# Altium project Handheld DMX Console - V3.PrjPcb
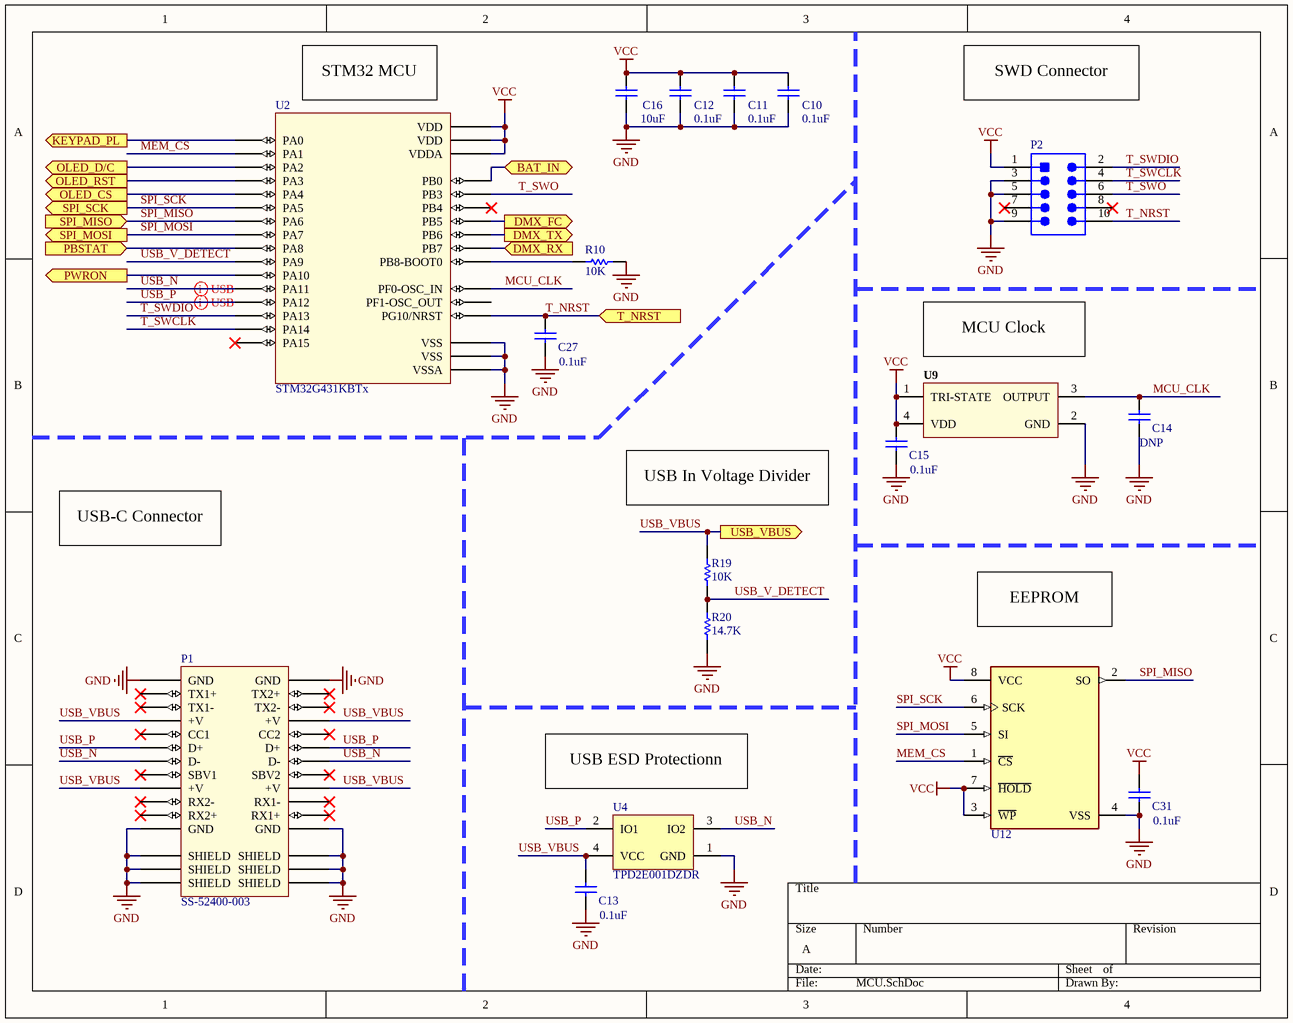
[diagram p0: MCU.SchDoc]
3 sheets, 52 parts. Net scope: flat (ports and power ports of the same name join across sheets).
Sheets:
  MCU.SchDoc
  User Interface.SchDoc
  Power.SchDoc

## Sheet MCU.SchDoc
size A; DocumentNumber: 2; SheetNumber: 2; SheetTotal: 3

### Parts
C10  0.1uF  [CAPC0603(1608)100_L]
C11  0.1uF  [CAPC0603(1608)100_L]
C12  0.1uF  [CAPC0603(1608)100_L]
C13  0.1uF  [CAPC0603(1608)100_L]
C14  DNP  [CAPC0603(1608)100_L]
C15  0.1uF  [CAPC0603(1608)100_L]
C16  10uF  [CAPC0603(1608)100_L]
C27  0.1uF  [CAPC0603(1608)100_L]
C31  0.1uF  [CAPC0603(1608)100_L]
P1  SS-52400-003  [SS-52400-00X]
P2  FTSH-105-01-F-DV-K  [SMTC-FTSH-105-01-L-DV-K_V]  (value not drawn)
R10  10K  [RESC0603(1608)_N]
R19  10K  [RESC0603(1608)_N]
R20  14.7K  [RESC0603(1608)_N]
U2  STM32G431KBTx  [LQFP32]
U4  TPD2E001DZDR  [DZD0004A_N]
U9  XLH536024.000000I  [ECS-396X_V]  (value not drawn)
U12  CAT25640VI-GT3  [FP-CAT25256VI-GT3-IPC_B]  (value not drawn)

### Ports
BAT_IN (bidir), DMX_FC (out), DMX_RX (in), DMX_TX (out), KEYPAD_PL (out), OLED_CS (out), OLED_D/C (out), OLED_RST (out), PBSTAT (in), PWRON (out), SPI_MISO (in), SPI_MOSI (out), SPI_SCK (out), T_NRST (in), USB_VBUS (out)

### Nets
GND: C10.1 C11.1 C12.1 C13.1 C14.1 C15.1 C16.1 C27.1 C31.1 P1.A1(GND) P1.A12(GND) P1.B1(GND) P1.B12(GND) P1.G1(SHIELD) P1.G2(SHIELD) P1.G3(SHIELD) P1.G4(SHIELD) P1.G5(SHIELD) P1.G6(SHIELD) P2.3 P2.5 P2.9 R10.2 R20.1 U2.14(VSSA) U2.16(VSS) U2.32(VSS) U4.1(GND) U9.2(GND) U12.4(VSS)
VCC: C10.2 C11.2 C12.2 C15.2 C16.2 C31.2 P2.1 U2.1(VDD) U2.15(VDDA) U2.17(VDD) U9.1(TRI-STATE) U9.4(VDD) U12.3(~{WP}) U12.7(~{HOLD}) U12.8(VCC)
BAT_IN: U2.13(PB0) ; port BAT_IN
MCU_CLK: C14.2 U2.2(PF0-OSC_IN) U9.3(OUTPUT)
MEM_CS: U2.6(PA1) U12.1(~{CS})
SPI_MISO: U2.11(PA6) U12.2(SO) ; port SPI_MISO
SPI_MOSI: U2.12(PA7) U12.5(SI) ; port SPI_MOSI
SPI_SCK: U2.10(PA5) U12.6(SCK) ; port SPI_SCK
T_NRST: C27.2 P2.10 U2.4(PG10/NRST) ; port T_NRST
T_SWCLK: P2.4 U2.24(PA14)
T_SWDIO: P2.2 U2.23(PA13)
T_SWO: P2.6 U2.26(PB3)
USB_N: P1.A7(D-) P1.B7(D-) U2.21(PA11) U4.3(IO2)
USB_P: P1.A6(D+) P1.B6(D+) U2.22(PA12) U4.2(IO1)
USB_V_DETECT: R19.2 R20.2 U2.19(PA9)
USB_VBUS: C13.2 P1.A4(+V) P1.A9(+V) P1.B4(+V) P1.B9(+V) R19.1 U4.4(VCC) ; port USB_VBUS
NetJ3_3: U2.28(PB5) ; port DMX_FC
NetJ3_4: U2.29(PB6) ; port DMX_TX
NetJ3_5: U2.30(PB7) ; port DMX_RX
NetR10_1: R10.1 U2.31(PB8-BOOT0)
NetU1_9: U2.18(PA8) ; port PBSTAT
NetU2_5: U2.5(PA0) ; port KEYPAD_PL
NetU2_7: U2.7(PA2) ; port OLED_D/C
NetU2_8: U2.8(PA3) ; port OLED_RST
NetU2_9: U2.9(PA4) ; port OLED_CS
NetU2_20: U2.20(PA10) ; port PWRON

Not connected (* = marked no-connect by the designer): P1 A2(TX1+)* A3(TX1-)* A5(CC1)* A8(SBV1)* A10(RX2-)* A11(RX2+)* B2(TX2+)* B3(TX2-)* B5(CC2)* B8(SBV2)* B10(RX1-)* B11(RX1+)*; P2 7* 8*; U2 3(PF1-OSC_OUT) 25(PA15)* 27(PB4)*

### Layout directives
differential pair: USB_N, USB_P

### Notes on the sheet
- (near U2) STM32 MCU
- SWD Connector
- (near U9) MCU Clock
- USB In Voltage Divider
- USB-C Connector
- EEPROM
- (near U4) USB ESD Protectionn

### Library data of the parts
C10-C16 C27 C31 = CMP-1035-00873-1: CAP 27pF 16V ±0.5pF 0603 (1608 Metric) Thickness 1mm SMD; Tolerance: Â±0.5pF; Case-Metric: 1608; Case-EIA: 0603; Value: 27pF; Max Thickness: 1 mm; Rated Voltage: 16 V; Technology: SMT
P2 = CMP-2000-05352-1: Male Header, Pitch 1.27 mm, 2 x 5 Position, Height 6.12 mm, RoHS, Tube; Manufacturer: Samtec; Number of Positions: 10; Connector Type: Header,Shrouded; Number of Positions Loaded: All; Row Spacing: 0.050"(1.27mm); Fastening Type: -; Package Reference: FTSH-105-01-L-DV-K; Termination: Solder; Package URL: http://suddendocs.samtec.com/prints/ftsh-1xx-xx-xxx-dv-xxx-footprint.pdf; Number of Rows: 2; Contact Finish Thickness: 3µin(0.08µm); Contact Type: MalePin; Manufacturer URL: http://www.samtec.com/; Contact Mating Length: 0.120"(3.05mm); Pitch: 0.050"(1.27mm); Series: FTSH; Features: -; Contact Finish: Gold; Color: Black; Family: RectangularConnectors-Headers,MalePins; Datasheet URL: http://suddendocs.samtec.com/prints/ftsh-1xx-xx-xxx-dv-xxx-mkt.pdf; Package Description: Male Header, Pitch 1.27 mm, 2 x 5 Position, Height 5.97 mm, Tail Length 4.32 mm; Mounting Type: SurfaceMount; Datasheet Version: Rev. ET, 10/1995; Category: Connectors,Interconnects; Packaging: Tube
R10 R19 R20 = CMP-1012-00001-1: Jumper 0603 (1608 Metric); Case-Metric: 1608; Value: 0.00 Ohm; Power: None; Case-EIA: 0603; Technology: SMT; Tolerance: None
U4 = CMP-2000-04961-1: Low-Capacitance 2-Channel ESD-Protection Array for High-Speed Data Interface, 0.9 to 5.5 V, -40 to 85 degC, 4-Pin SOP (DZD), Green (RoHS & no Sb/Br), Tape and Reel; Manufacturer: Texas Instruments; Manufacturer Product Page: TPD2E001DZDRSpecifications; Voltage - Reverse Standoff (Typ): 5.5V(Max); Online Catalog: TPD2ESeries; EDA / CAD Models: DownloadfromAcceleratedDesigns; Product Training Modules: ESDProtectionBasics; Bidirectional Channels: 2; Voltage - Breakdown (Min): 11V; Other Names: 296-24770-6; Power Line Protection: Yes; Package Reference: DZD4; Family: TVS-Diodes; Operating Temperature: -40degC~85degC(TA); Package / Case: TO-253-4,TO-253AA; Supplier Device Package: 4-SOP; Power - Peak Pulse: -; Type: Steering(RailtoRail); Unidirectional Channels: -; Standard Package: 1; Category: CircuitProtection; Datasheet Version: Rev. H, 08/2014; Capacitance @ Frequency: -; Packaging: Digi-Reel; Manufacturer URL: http://www.ti.com/; Series: -; Voltage - Clamping (Max) @ Ipp: -; Applications: Ethernet; Mounting Type: SurfaceMount; Current - Peak Pulse (10/1000µs): -; Datasheet URL: http://www.ti.com/general/docs/lit/getliterature.tsp?genericPartNumber=TPD2E001&fileType=pdf; Package Description: 4-Pin Small Outline Package, Body 2.92 x 1.3 mm, Pitch 1.92 mm
U9 = CMP-2000-06192-1: Clock Oscillator, 3.3 V, 25 MHz, -55 to 125 degC, 4-Pin SMD, RoHS, Tape and Reel; Manufacturer: ECS; Supply Voltage: 3.3V; Frequency Stability: 100PPM; Output Format: HCMOS; Load Capacitance: 30pF; Frequency: 25Hz; Series: ECS3963; Mounting Technology: SurfaceMount; Package / Case: 5mmx3.2mm; Dimensions: 3.2mmWx5mmL; Minimum Operating Temperature: -55C; Manufacturer URL: https://www.ecsxtal.com/; Product: SMDOscillators; Datasheet Version: 04/2012; Datasheet URL: http://www.mouser.com/ds/2/122/ecs-3961_3963-18682.pdf; Package Reference: 396X; Package Description: 4-Pin Surface Mount Device, Body 5 x 3.2 mm, Pitch 2.54 mm; Maximum Operating Temperature: +125C; RoHS: Details; Termination Style: SMD/SMT; Packaging: Reel
U12 = CMP-07117-000003-1: IC EEPROM 256K SPI 20MHZ 8SOIC; Manufacturer: ON Semiconductor; Manufacturer Part Number: CAT25256VI-GT3; Max Supply Voltage: 5.5V; Standoff Height: 0.1mm; Memory Size: 256Kbits; Nominal Supply Current: 2-4mA; Min Supply Voltage: 1.8V; RoHS: TRUE; Temperature: -40°C to +85°C; Category: IC; Mouser Description: EEPROM Serial-SPI 256K-bit 32K x 8 2.5V/3.3V/5V 8-Pin SOIC N T/R; Lead Free: Yes; Ipc Land Pattern Name: SOIC127P600X155-8; ComponentLink2Description: Datasheet; Digikey Description: IC EEPROM 256K SPI 20MHZ 8SOIC; Memory Type: EEPROM; Footprint Url: https://www.onsemi.com/pub/Collateral/751BD.PDF; Interface: SPI; Automotive: No; Device Class L2: Memory; Octopart: https://octopart.com/cat25256vi-gt3-on+semiconductor-10567745; ComponentLink2URL: https://www.onsemi.cn/PowerSolutions/document/CAT25256-D.PDF; Temperature Range Low: -40°C; Temperature Range High: +85°C; Device Class L3: EEPROM; Height: 1.75mm; Frequency: 20MHz; Package: SOIC8; Device Class L1: Integrated Circuits (ICs)

## Sheet User Interface.SchDoc
size A
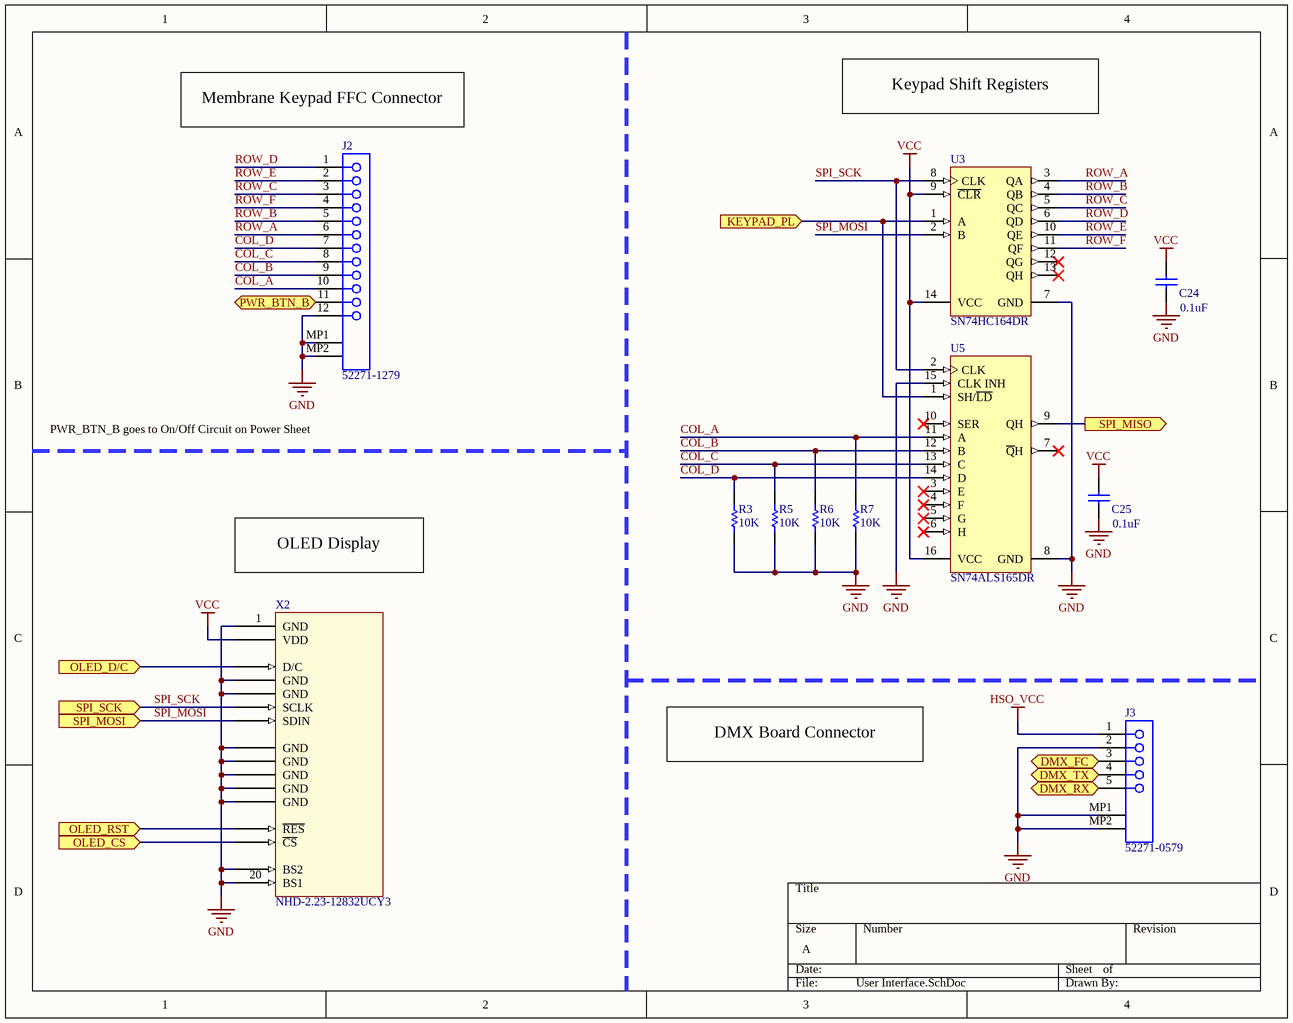
[diagram p1: User Interface.SchDoc]

### Parts
C24  0.1uF  [CAPC0603(1608)100_L]
C25  0.1uF  [CAPC0603(1608)100_L]
J2  52271-1279  [MOLX-52271-1279]
J3  52271-0579  [MOLX-52271-0579]
R3  10K  [RESC0603(1608)_N]
R5  10K  [RESC0603(1608)_N]
R6  10K  [RESC0603(1608)_N]
R7  10K  [RESC0603(1608)_N]
U3  SN74HC164DR  [D0014A_M]
U5  SN74ALS165DR  [D0016A_L]
X2  NHD-2.23-12832UCY3  [NHD-2.23-12832UCY3]

### Ports
DMX_FC (in), DMX_RX (out), DMX_TX (in), KEYPAD_PL (in), OLED_CS (in), OLED_D/C (in), OLED_RST (in), PWR_BTN_B (bidir), SPI_MISO (out), SPI_MOSI (in), SPI_SCK (in)

### Nets
GND: C24.1 C25.1 J2.12 J2.MP1 J2.MP2 J3.2 J3.MP1 J3.MP2 R3.1 R5.1 R6.1 R7.1 U3.7(GND) U5.8(GND) U5.15(CLK_INH) X2.1(GND) X2.5(GND) X2.6(GND) X2.10(GND) X2.11(GND) X2.12(GND) X2.13(GND) X2.14(GND) X2.19(BS2) X2.20(BS1)
HSO_VCC: J3.1
VCC: C24.2 C25.2 U3.9(~{CLR}) U3.14(VCC) U5.16(VCC) X2.2(VDD)
COL_A: J2.10 R7.2 U5.11(A)
COL_B: J2.9 R6.2 U5.12(B)
COL_C: J2.8 R5.2 U5.13(C)
COL_D: J2.7 R3.2 U5.14(D)
ROW_A: J2.6 U3.3(QA)
ROW_B: J2.5 U3.4(QB)
ROW_C: J2.3 U3.5(QC)
ROW_D: J2.1 U3.6(QD)
ROW_E: J2.2 U3.10(QE)
ROW_F: J2.4 U3.11(QF)
SPI_MISO: U5.9(QH) ; port SPI_MISO
SPI_MOSI: U3.2(B) X2.8(SDIN) ; port SPI_MOSI
SPI_SCK: U3.8(CLK) U5.2(CLK) X2.7(SCLK) ; port SPI_SCK
NetJ2_11: J2.11 ; port PWR_BTN_B
NetJ3_3: J3.3 ; port DMX_FC
NetJ3_4: J3.4 ; port DMX_TX
NetJ3_5: J3.5 ; port DMX_RX
NetU2_5: U3.1(A) U5.1(SH/~{LD}) ; port KEYPAD_PL
NetU2_7: X2.4(D/C) ; port OLED_D/C
NetU2_8: X2.16(~{RES}) ; port OLED_RST
NetU2_9: X2.17(~{CS}) ; port OLED_CS

Not connected (* = marked no-connect by the designer): U3 12(QG)* 13(QH)*; U5 3(E)* 4(F)* 5(G)* 6(H)* 7(~{Q}H)* 10(SER)*; X2 3(NC) 9(NC) 15(NC) 18(NC)

### Notes on the sheet
- (near J2) Membrane Keypad FFC Connector
- Keypad Shift Registers
- PWR_BTN_B goes to On/Off Circuit on Power Sheet
- OLED Display
- DMX Board Connector

### Library data of the parts
C24 C25 = CMP-1035-00873-1: as C10 on sheet MCU; Value: 27pF; Max Thickness: 1 mm; Rated Voltage: 16 V; Technology: SMT
J2 = 52271-1279: 1.0 mm Pitch Easy-On(TM) Type FPC Connector, 3.0 mm Mated Height, Right Angle, ZIF, SMT, Bottom Contact, 12 Circuits, -40 to 85 degC, ELV and RoHS Compliant, Tape and Reel; Manufacturer: Molex; Circuits (Loaded): 12; Current (Max per Contact): 0.5A; Durability (mating cycles max): 30; Entry Angle: 90degrees Angle; Mated Height: 3.00mm; Material - Metal: Phosphor Bronze; Material - Plating Mating: Tin-Bismuth; PCB Locator: No; PCB Retention: Yes; Pitch - Mating Interface: 1.00mm; Voltage (Max): 50V AC (RMS)/DC; PackageVersion: Rev. B, 04/2004; PackageReference: 52271-1279; PackageDescription: 12-Lead FPC Connector, Pitch 1.0 mm; Supplier 1: Farnell; Supplier Part Number 1: 1079952; Supplier 2: Newark; Supplier Part Number 2: 72M5544; Supplier 3: Mouser; Supplier Part Number 3: 538-52271-1279; Contact Position: Bottom; Material - Plating Termination: Tin-Bismuth; Number of Rows: 1; Orientation: Right Angle; Packing: Tape and Reel; Pitch - Termination Interface: 1.00mm; Polarized to PCB: Yes; RoHS: TRUE; Stackable: No; Mounting Technology: Surface Mount; PartNumber: 52271-1279; ComponentLink1Description: Manufacturer URL; ComponentLink1URL: http://www.molex.com/molex/index.jsp; ComponentLink2Description: Datasheet; ComponentLink2URL: http://www.molex.com/webdocs/datasheets/pdf/en-us/0522711279_FFC_FPC_CONNECTORS.pdf; ComponentLink3Description: Package Specification; ComponentLink3URL: http://www.molex.com/pdm_docs/sd/522711279_sd.pdf
J3 = 52271-0579: 1.0 mm Pitch Easy-On(TM) Type FPC Connector, 3.0 mm Mated Height, Right Angle, ZIF, SMT, Bottom Contact, 5 Circuits, -40 to 85 degC, ELV and RoHS Compliant, Tape and Reel; Manufacturer: Molex; Circuits (Loaded): 5; Current (Max per Contact): 0.5A; Durability (mating cycles max): 30; Entry Angle: 90degrees Angle; Mated Height: 3.00mm; Material - Metal: Phosphor Bronze; Material - Plating Mating: Tin-Bismuth; PCB Locator: No; PCB Retention: Yes; Pitch - Mating Interface: 1.00mm; Voltage (Max): 50V AC (RMS)/DC; PackageVersion: Rev. B, 04/2004; PackageReference: 52271-0579; PackageDescription: 5-Lead FPC Connector, Pitch 1.0 mm; Supplier 1: Mouser; Supplier Part Number 1: 538-52271-0579; Contact Position: Bottom; Material - Plating Termination: Tin-Bismuth; Number of Rows: 1; Orientation: Right Angle; Packing: Tape and Reel; Pitch - Termination Interface: 1.00mm; Polarized to PCB: Yes; RoHS: TRUE; Stackable: No; Mounting Technology: Surface Mount; PartNumber: 52271-0579; ComponentLink1Description: Manufacturer URL; ComponentLink1URL: http://www.molex.com/molex/index.jsp; ComponentLink2Description: Datasheet; ComponentLink2URL: http://www.molex.com/webdocs/datasheets/pdf/en-us/0522710579_FFC_FPC_CONNECTORS.pdf; ComponentLink3Description: Package Specification; ComponentLink3URL: http://www.molex.com/pdm_docs/sd/522710579_sd.pdf
R3 R5-R7 = CMP-1012-00001-1: as R10 on sheet MCU; Technology: SMT; Tolerance: None
U3 = CMP-0780-00006-3: 8-Bit Parallel-Out Serial Shift Registers, D0014A, LARGE T&R; Manufacturer: Texas Instruments; 3-State Output: No; F @ Nom Voltage(Max)(Mhz): 28; Bits: 8; Output Type: CMOS; VCC(Max)(V): 6; Technology Family: HC; VCC(Min)(V): 2; tpd @ Nom Voltage(Max)(ns): 38; ICC @ Nom Voltage(Max)(mA): 0.08; Rating: Catalog; Output Drive (IOL/IOH)(Max)(mA): 5.2/-5.2; PackageVersion: http://www.ti.com/lit/ml/mpds177g/mpds177g.pdf; Voltage(Nom)(V): 6; Code_JEDEC: MS-012; DatasheetVersion: SCLS115F; Generic Part Number: SN74HC164; Operating Temperature Range(C): -40 to 125; Input Type: CMOS; PackageReference: D0014A
U5 = CMP-0780-00014-3: Parallel-Load 8-Bit Serial Shift Registers, D0016A, LARGE T&R; Manufacturer: Texas Instruments; VCC(Min)(V): 4.5; Output Type: TTL; Bits: 8; ICC @ Nom Voltage(Max)(mA): 24; F @ Nom Voltage(Max)(Mhz): 75; tpd @ Nom Voltage(Max)(ns): 14; 3-State Output: No; Technology Family: ALS; Voltage(Nom)(V): 5; Output Drive (IOL/IOH)(Max)(mA): 8/-0.4; VCC(Max)(V): 5.5; Rating: Catalog; Operating Temperature Range(C): 0 to 70; DatasheetVersion: SDAS157B; Generic Part Number: SN74ALS165; Input Type: TTL; PackageVersion: http://www.ti.com/lit/ml/mpds178g/mpds178g.pdf; Code_JEDEC: MS-012 variation AC; PackageReference: D0016A

## Sheet Power.SchDoc
size A; DocumentNumber: 1; SheetNumber: 1; SheetTotal: 3
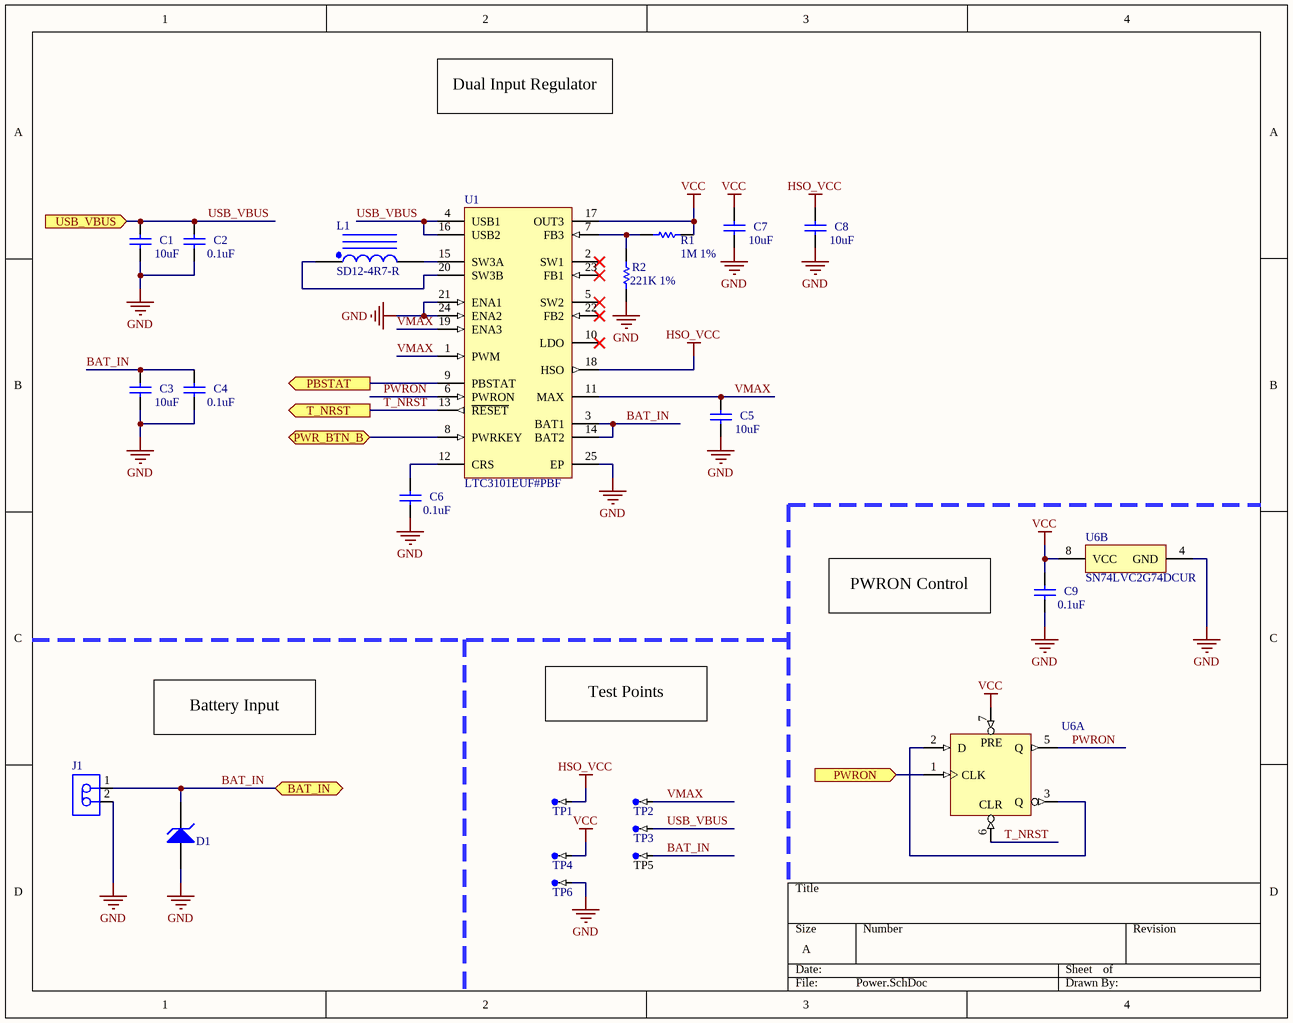
[diagram p2: Power.SchDoc]

### Parts
(Parts that share a designator on the sheet are numbered #1, #2 ... from top to bottom, then left to right.)
C1  10uF  [CAPC0603(1608)100_L]
C2  0.1uF  [CAPC0603(1608)100_L]
C3  10uF  [CAPC0603(1608)100_L]
C4  0.1uF  [CAPC0603(1608)100_L]
C5  10uF  [CAPC0603(1608)100_L]
C6  0.1uF  [CAPC0603(1608)100_L]
C7  10uF  [CAPC0603(1608)100_L]
C8  10uF  [CAPC0603(1608)100_L]
C9  0.1uF  [CAPC0603(1608)100_L]
D1  XGD10603MR  [TECO-0603_V]  (value not drawn)
J1  640456-2  [TECO-640456-2_V]  (value not drawn)
L1  SD12-4R7-R  [EATN-SD12_V]
R1  1M 1%  [RESC0603(1608)_N]
R2  221K 1%  [RESC0603(1608)_N]
TP1  TP-SM-C-100  [TP-SM-C-100]  (value not drawn)  (no BOM)
TP2  TP-SM-C-100  [TP-SM-C-100]  (value not drawn)  (no BOM)
TP3  TP-SM-C-100  [TP-SM-C-100]  (value not drawn)  (no BOM)
TP4  TP-SM-C-100  [TP-SM-C-100]  (value not drawn)  (no BOM)
TP5  TP-SM-C-100  [TP-SM-C-100]  (value not drawn)  (no BOM)
TP6  TP-SM-C-100  [TP-SM-C-100]  (value not drawn)  (no BOM)
U1  LTC3101EUF#PBF  [LT-UF-24_N]
U6#1  SN74LVC2G74DCUR  [DCU0008A_N]  (part B of 2)
U6#2  SN74LVC2G74DCUR  [DCU0008A_N]  (value not drawn)  (part A of 2)

### Ports
BAT_IN (bidir), PBSTAT (out), PWR_BTN_B (bidir), PWRON (in), T_NRST (out), USB_VBUS (in)

### Nets
GND: C1.1 C2.2 C3.1 C4.2 C5.1 C6.2 C7.1 C8.1 C9.2 D1.1(A) J1.2 R2.1 TP6.1 U1.21(ENA1) U1.24(ENA2) U1.25(EP) U6#1.4(GND)
HSO_VCC: C8.2 TP1.1 U1.18(HSO)
VCC: C7.2 C9.1 R1.1 TP4.1 U1.17(OUT3) U6#1.8(VCC) U6#2.7(~{PRE})
BAT_IN: C3.2 C4.1 D1.2(K) J1.1 TP5.1 U1.3(BAT1) U1.14(BAT2) ; port BAT_IN
PWRON: U1.6(PWRON) U6#2.5(Q)
T_NRST: U1.13(~{RESET}) U6#2.6(~{CLR}) ; port T_NRST
USB_VBUS: C1.2 C2.1 TP3.1 U1.4(USB1) U1.16(USB2) ; port USB_VBUS
VMAX: C5.2 TP2.1 U1.1(PWM) U1.11(MAX) U1.19(ENA3)
NetC6_1: C6.1 U1.12(CRS)
NetJ2_11: U1.8(PWRKEY) ; port PWR_BTN_B
NetL1_1: L1.1 U1.20(SW3B)
NetL1_2: L1.2 U1.15(SW3A)
NetR1_2: R1.2 R2.2 U1.7(FB3)
NetU1_9: U1.9(PBSTAT) ; port PBSTAT
NetU2_20: U6#2.1(CLK) ; port PWRON
NetU6#2_2: U6#2.2(D) U6#2.3(Q)

Not connected (* = marked no-connect by the designer): U1 2(SW1)* 5(SW2)* 10(LDO)* 22(FB2)* 23(FB1)*

### Notes on the sheet
- Dual Input Regulator
- PWRON Control
- Battery Input
- Test Points
- (in symbol CMP-0859-00648-3, part A) PRE; CLR

### Library data of the parts
C1-C9 = CMP-1035-00873-1: as C10 on sheet MCU; Value: 27pF; Max Thickness: 1 mm; Rated Voltage: 16 V; Technology: SMT
D1 = CMP-2000-06889-1: ESD Protector Overvoltage Protection Device, 0.25 pF, 24 V, -55 to 125 degC, 2-Pin SMD (0603), RoHS, Tape and Reel; Manufacturer: TE Connectivity; Capacitance Value: 0.25pF; Rad Hardened: No; Leakage Current (Max): 10uA; Clamping Voltage: 45(Typ)V; Product Height (mm): 0.55mm; Working Voltage: 24V; Product Length (mm): 1.7(Max)mm; Direction Type: Bi-Directional; Number of  Elements: 1; Product Depth (mm): 1(Max)mm; Datasheet Version: Rev. G, 11/2012; Package Reference: 0603; Operating Temperature Max Deg. C: 125C; Packaging: TapeandReel/Box; Leakage Current: 10uA; Datasheet URL: https://datasheet.ciiva.com/30563/eng-ss-scd27256-c-30563476.pdf; Mounting: SurfaceMount; Manufacturer URL: http://www.te.com/; Operating Temperature Classification: Military; Reverse Stand-off Voltage: 24V; Working Voltage (Max): 24V; Mounting Style: SurfaceMount; Operating Temperature Min Deg. C: -55C; Operating Temp Range: -55Cto125C; Pin Count: 2; Mounting Technology: SurfaceMount; Package Description: 2-Pin Surface Mount Device, Body 1.60 x 0.825 mm
J1 = CMP-2000-05417-1: Male Header, Pitch 2.54 mm, 1 x 2 Position, Height 10.49 mm, Tail Length 3.556 mm, -55 to 105 degC, RoHS, Bulk; Manufacturer: TE Connectivity; Standards: RoHSCompliant,ELVCompliant,UL94V-0; Material, Housing: Polyester; Agency Approvals: CSA,UL; Brand/Series: MTA-100Series; Contact Centerline Spacing: 0.100 / in.; Material, Contact: CopperAlloy; Current, Rating: 5 / A; Color, Housing: White; Contact Termination Area Plating: Tin; Special Features: Pinstrip; Number of Positions: 2; Pin Spacing: 0.1 / "; Temperature, Operating: -55to+105 / degC; Angle: Straight; Mount Angle: Vertical; Connector Type: MTA-100; Primary Type: InterconnectSystem; Voltage, Rating: 250 / V; Mounting Hole Size: 0.04 / "; Number of Rows: 1; Termination: Solder; Length, Terminal Post: 0.14 / in.; Manufacturer URL: http://www.te.com/; Color: White; Size, Post: 0.025 / in.; Contact Shape: Square; Mounting Type: PCMount; Datasheet URL: https://datasheet.ciiva.com/11746/0900766b80eb7fdd-11746365.pdf; Type: PCBPlug; Datasheet Version: Rev. W, 06/2004; Number of Contacts: 2; Flammability Rating: UL94V-0; Contact Plating: Tin; Length, Pin: 0.14 / "; Contact Mating Area Plating: Tin; Length, Overall: 0.2 / "
L1 = CMP-2000-07038-1: SD Series High Power Density, Low Profile, Shielded Inductor, 4.7 uH, -40 to 85 degC, 2-Pin SMD, RoHS, Tape and Reel; Manufacturer: Eaton; Maximum DC Resistance: 117.7mOhms; Unit Weight: 0.032000oz; Test Frequency: 100kHz; Inductance: 4.7uH; Maximum DC Current: 1.29A; Brand: Coiltronics/Eaton; Tolerance: 20%; Core Material: Ferrite; Type: LowProfilePowerInductor; Height: 1.2mm; Width: 5.2mm; Product Category: FixedInductors; Shielding: Shielded; Operating Temperature Range: -40Cto+85C; Series: SD; Datasheet Version: 03/2007; Datasheet URL: http://datasheet.octopart.com/SD12-4R7-R-Coiltronics-datasheet-5402826.pdf; Package Description: 2-Pin Surface Mount Device, Body 5.2 x 5.2 mm; RoHS: True; Mounting Technology: SurfaceMount; Packaging: Reel; Package Reference: SD12; Length: 5.2mm; Product: PowerInductors; Factory Pack Quantity: 3800; Termination Style: SMD/SMT; Manufacturer URL: http://www.eaton.com/
R1 R2 = CMP-1012-00001-1: as R10 on sheet MCU; Technology: SMT; Tolerance: None
TP1-TP6 = CMP-0484-00002-2: Test Point, Surface Mount, Circular, Pad Diameter 1 mm; Manufacturer: No Vendor; PartNumber: TP-SM-C-100
U1 = CMP-0478-00246-1: Wide Vin, Multi-Output DC/DC Converter and PowerPath Controller, 1.8 to 5.5 V Vin, 24-pin QFN (UF-24), -40 to 85 degC, Pb-Free; Manufacturer: Linear Technology; Number of Outputs: 3; Vin Max(V): 5.5; Vin Min(V): 1.8; PackageDescription: 24-Pin Plastic QFN, Body 4 x 4 mm, Pitch 0.5 mm; DatasheetVersion: Rev. B; ComponentLink2URL: http://cds.linear.com/docs/en/datasheet/3101fb.pdf; Code_JEDEC: MO-220; RoHS: TRUE; Mounting Technology: Surface Mount; PartNumber: LTC3101EUF#PBF; PackageReference: UF24; ComponentLink1URL: http://www.linear.com/; ComponentLink3Description: Package Specification; ComponentLink2Description: Datasheet; PackageVersion: Rev. B, 02/2012; ComponentLink3URL: http://cds.linear.com/docs/en/packaging/%28UF24%29%20QFN%2005-08-1697%20Rev%20B.pdf; ComponentLink1Description: Manufacturer URL
U6#1 U6#2 = CMP-0859-00648-3: Single Positive-Edge-Triggered D-Type Flip-Flop with Clear and Preset, DCU0008A, LARGE T&R; Manufacturer: Texas Instruments; F @ Nom Voltage(Max)(Mhz): 150; Bits(#): 1; Voltage(Nom)(V): 1.8,2.5,3.3,5; tpd @ Nom Voltage(Max)(ns): 13.4,7.1,5.9,4.1; Technology Family: LVC; Output Drive (IOL/IOH)(Max)(mA): 32/-32; ICC @ Nom Voltage(Max)(mA): 0.01; 3-State Output: No; Output Type: CMOS; VCC(Max)(V): 5.5; Logic: True; Input Type: CMOS/TTL; Rating: Catalog; VCC(Min)(V): 1.65; Sub-Family: D-Type Flip-Flop; Operating Temperature Range(C): -40 to 125,-40 to 85; Generic Part Number: SN74LVC2G74; Schmitt Trigger: No; PackageReference: DCU0008A; DatasheetVersion: SCES203O

## Nets that join several sheets
GND: MCU (30 pins), User Interface (25 pins), Power (17 pins)
HSO_VCC: User Interface (J3.1), Power (C8.2 TP1.1 U1.18)
VCC: MCU (15 pins), User Interface (6 pins), Power (7 pins)
BAT_IN: MCU (U2.13), Power (7 pins)
NetJ2_11: User Interface (J2.11), Power (U1.8)
NetJ3_3: MCU (U2.28), User Interface (J3.3)
NetJ3_4: MCU (U2.29), User Interface (J3.4)
NetJ3_5: MCU (U2.30), User Interface (J3.5)
NetU1_9: MCU (U2.18), Power (U1.9)
NetU2_5: MCU (U2.5), User Interface (U3.1 U5.1)
NetU2_7: MCU (U2.7), User Interface (X2.4)
NetU2_8: MCU (U2.8), User Interface (X2.16)
NetU2_9: MCU (U2.9), User Interface (X2.17)
NetU2_20: MCU (U2.20), Power (U6#2.1)
SPI_MISO: MCU (U2.11 U12.2), User Interface (U5.9)
SPI_MOSI: MCU (U2.12 U12.5), User Interface (U3.2 X2.8)
SPI_SCK: MCU (U2.10 U12.6), User Interface (U3.8 U5.2 X2.7)
T_NRST: MCU (C27.2 P2.10 U2.4), Power (U1.13 U6#2.6)
USB_VBUS: MCU (7 pins), Power (5 pins)